# EAGLE design B3PIC_picfinalcurrentreading (EAGLE 9.1.3)
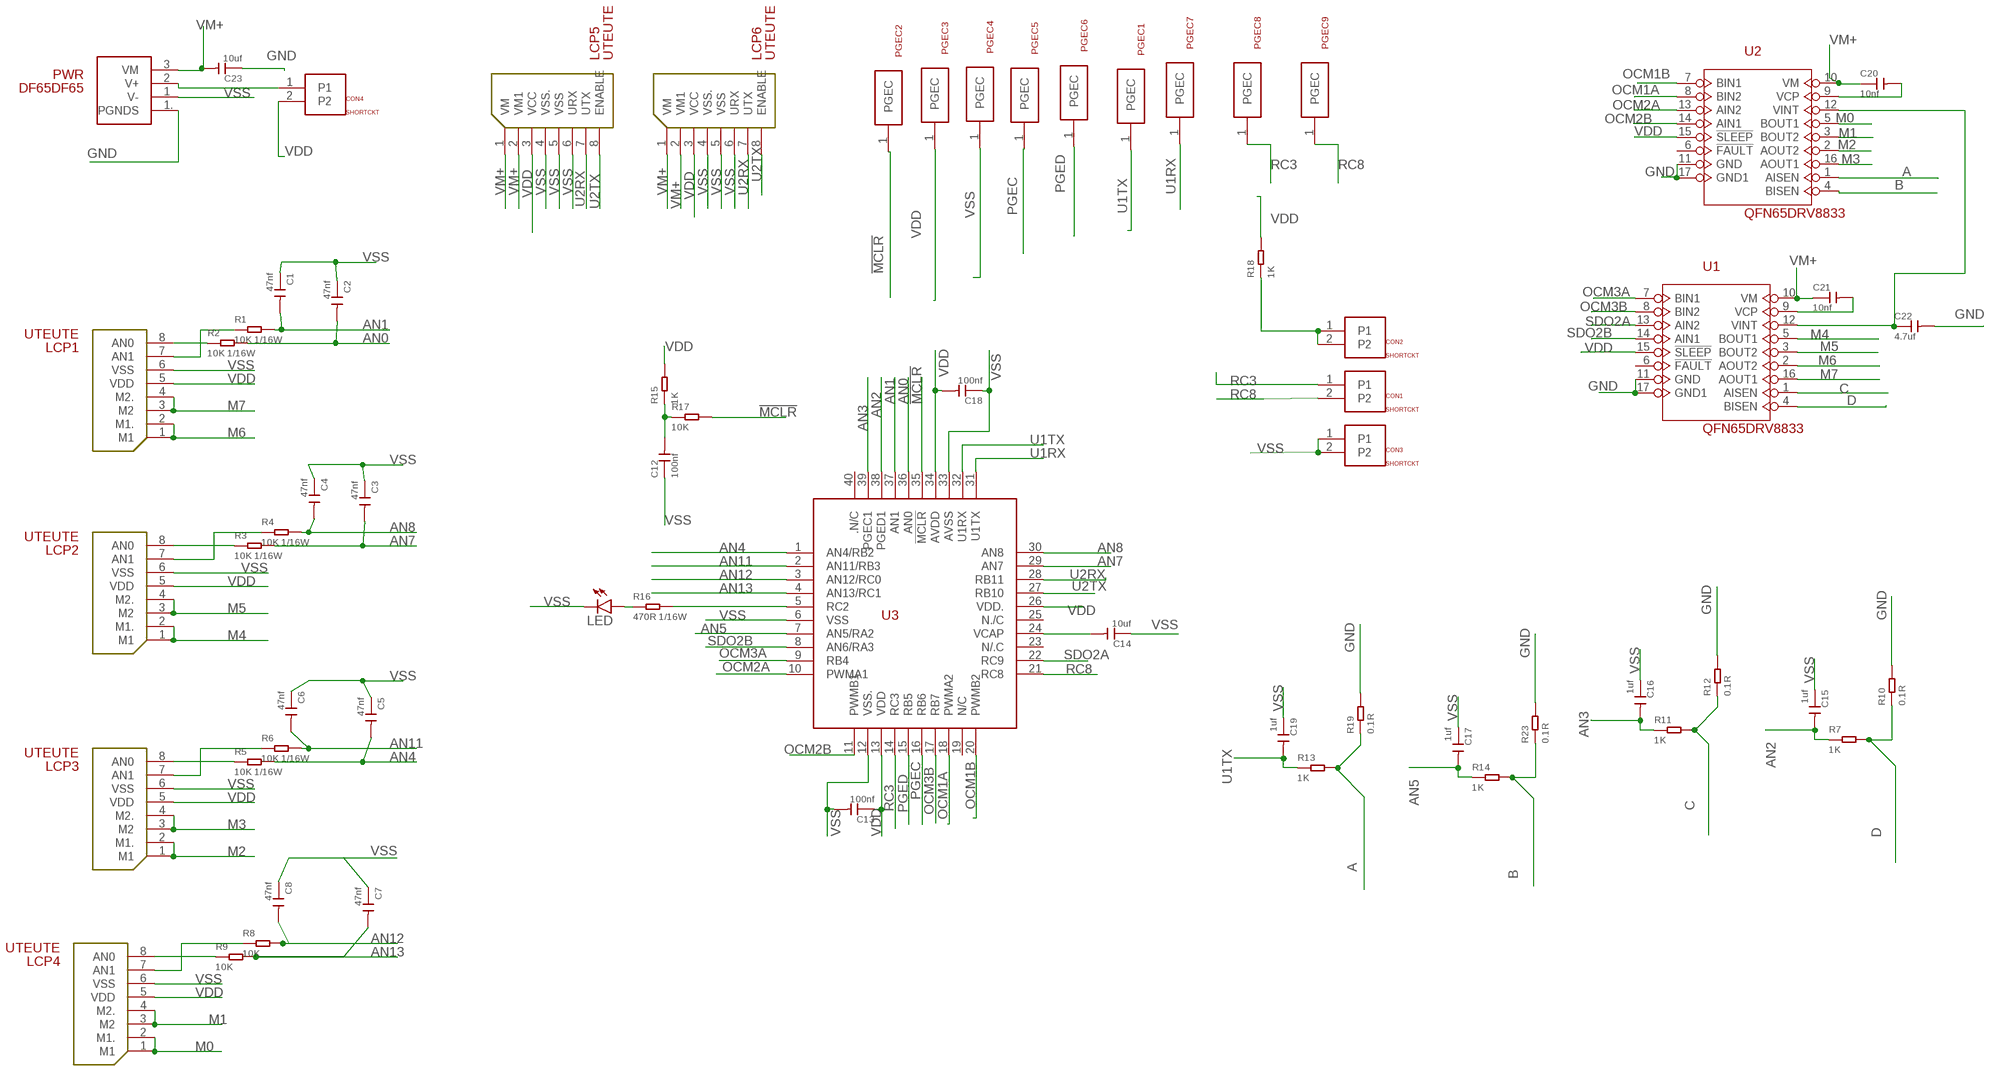
[diagram p0: schematic, sheet 1]

## Parts
C1  47nf  CERAMIC-47NF-25V-10%-X7R(0402)  [C0402]
C2  47nf  CERAMIC-47NF-25V-10%-X7R(0402)  [C0402]
C3  47nf  CERAMIC-47NF-25V-10%-X7R(0402)  [C0402]
C4  47nf  CERAMIC-47NF-25V-10%-X7R(0402)  [C0402]
C5  47nf  CERAMIC-47NF-25V-10%-X7R(0402)  [C0402]
C6  47nf  CERAMIC-47NF-25V-10%-X7R(0402)  [C0402]
C7  47nf  CERAMIC-47NF-25V-10%-X7R(0402)  [C0402]
C8  47nf  CERAMIC-47NF-25V-10%-X7R(0402)  [C0402]
C12  100nf  CERAMIC-100NF-25V-10%-X7R(0402)  [C0402]
C13  100nf  CERAMIC-100NF-25V-10%-X7R(0402)  [C0402]
C14  10uf  CERAMIC-10UF-6.3V-20%-X5R(0402)  [C0402]
C15  1uf  CERAMIC-1UF-10V-10%-X5R(0402)  [C0402]
C16  1uf  CERAMIC-1UF-10V-10%-X5R(0402)  [C0402]
C17  1uf  CERAMIC-1UF-10V-10%-X5R(0402)  [C0402]
C18  100nf  CERAMIC-100NF-25V-10%-X7R(0402)  [C0402]
C19  1uf  CERAMIC-1UF-10V-10%-X5R(0402)  [C0402]
C20  10nf  CERAMIC-10NF-50V-10%-X7R(0402)  [C0402]
C21  10nf  CERAMIC-10NF-50V-10%-X7R(0402)  [C0402]
C22  4.7uf  CERAMIC-4.7UF-6.3V-20%-X5R(0402)  [C0402]
C23  10uf  CERAMIC-10UF-6.3V-20%-X5R(0402)  [C0402]
CON1  SHORTCKT  [SHORT]
CON2  SHORTCKT  [SHORT]
CON3  SHORTCKT  [SHORT]
CON4  SHORTCKT  [SHORT]
LCP1  UTEUTE  [UTE]
LCP2  UTEUTE  [UTE]
LCP3  UTEUTE  [UTE]
LCP4  UTEUTE  [UTE]
LCP5  UTEUTE  [UTE]
LCP6  UTEUTE  [UTE]
LED  LEDCHIP-LED0603  [CHIP-LED0603]
PGEC1  PGECPGEC  [PGEC]
PGEC2  PGECPGEC  [PGEC]
PGEC3  PGECPGEC  [PGEC]
PGEC4  PGECPGEC  [PGEC]
PGEC5  PGECPGEC  [PGEC]
PGEC6  PGECPGEC  [PGEC]
PGEC7  PGECPGEC  [PGEC]
PGEC8  PGECPGEC  [PGEC]
PGEC9  PGECPGEC  [PGEC]
PWR  DF65DF65  [DF65]
R1  10K 1/16W  SMD-RES-10K-1%-1/16W(0402)  [R0402]
R2  10K 1/16W  SMD-RES-10K-1%-1/16W(0402)  [R0402]
R3  10K 1/16W  SMD-RES-10K-1%-1/16W(0402)  [R0402]
R4  10K 1/16W  SMD-RES-10K-1%-1/16W(0402)  [R0402]
R5  10K 1/16W  SMD-RES-10K-1%-1/16W(0402)  [R0402]
R6  10K 1/16W  SMD-RES-10K-1%-1/16W(0402)  [R0402]
R7  1K  SMD-RES-1K-5%-1/16W(0402)  [R0402]
R8  10K  SMD-RES-10K-5%-1/(0402)  [R0402]
R9  10K  SMD-RES-10K-5%-1/(0402)  [R0402]
R10  0.1R  SMD-RES-0.1R-5%-1/8W(0805)  [R0805]
R11  1K  SMD-RES-1K-5%-1/16W(0402)  [R0402]
R12  0.1R  SMD-RES-0.1R-5%-1/8W(0805)  [R0805]
R13  1K  SMD-RES-1K-5%-1/16W(0402)  [R0402]
R14  1K  SMD-RES-1K-5%-1/16W(0402)  [R0402]
R15  1K  SMD-RES-1K-5%-1/16W(0402)  [R0402]
R16  470R 1/16W  SMD-RES-470R-5%-1/16W(0402)  [R0402]
R17  10K  SMD-RES-10K-5%-1/(0402)  [R0402]
R18  1K  SMD-RES-1K-5%-1/16W(0402)  [R0402]
R19  0.1R  SMD-RES-0.1R-5%-1/8W(0805)  [R0805]
R23  0.1R  SMD-RES-0.1R-5%-1/8W(0805)  [R0805]
U1  QFN65DRV8833  [QFN65P400X400X80-17N]
U2  QFN65DRV8833  [QFN65P400X400X80-17N]
U3  PIC32MM0064GPL036PIC32MM0064GPL36  [UQFN40MV5X5MM]

## Nets
!MCLR!: PGEC2.1(PGEC) R17.2 U3.35(!MCLR!)
A: R13.2 R19.1 U2.1(AISEN)
AN0: C2.2 R2.2 U3.36(AN0)
AN1: C1.2 R1.2 U3.37(AN1)
AN2: C15.2 R7.1 U3.38(PGED1)
AN3: C16.2 R11.1 U3.39(PGEC1)
AN4: C5.2 R5.2 U3.1(AN4/RB2)
AN5: C17.2 R14.1 U3.7(AN5/RA2)
AN7: C3.2 R3.2 U3.29(AN7)
AN8: C4.2 R4.2 U3.30(AN8)
AN11: C6.2 R6.2 U3.2(AN11/RB3)
AN12: C8.2 R8.2 U3.3(AN12/RC0)
AN13: C7.2 R9.2 U3.4(AN13/RC1)
B: R14.2 R23.1 U2.4(BISEN)
C: R11.2 R12.1 U1.1(AISEN)
D: R7.2 R10.1 U1.4(BISEN)
GND: C22.2 C23.1 PWR.1.(PGNDS) R10.2 R12.2 R19.2 R23.2 U1.11(GND) U1.17(GND1) U2.11(GND) U2.17(GND1)
M0 [motor line]: LCP4.1(M1) LCP4.2(M1.) U2.5(BOUT1)
M1 [motor line]: LCP4.3(M2) LCP4.4(M2.) U2.3(BOUT2)
M2 [motor line]: LCP3.1(M1) LCP3.2(M1.) U2.2(AOUT2)
M3 [motor line]: LCP3.3(M2) LCP3.4(M2.) U2.16(AOUT1)
M4 [motor line]: LCP2.1(M1) LCP2.2(M1.) U1.5(BOUT1)
M5 [motor line]: LCP2.3(M2) LCP2.4(M2.) U1.3(BOUT2)
M6 [motor line]: LCP1.1(M1) LCP1.2(M1.) U1.2(AOUT2)
M7 [motor line]: LCP1.3(M2) LCP1.4(M2.) U1.16(AOUT1)
N$2: LCP1.8(AN0) R2.1
N$3: CON4.1 PWR.2(V+)
N$4: LCP3.7(AN1) R6.1
N$6: LCP2.8(AN0) R3.1
N$7: LCP4.7(AN1) R8.1
N$8: LCP3.8(AN0) R5.1
N$9: LCP2.7(AN1) R4.1
N$10: LCP1.7(AN1) R1.1
N$11: C12.2 R15.1 R17.1
N$12: R16.2 U3.5(RC2)
N$13: LED.A R16.1
N$15: CON2.1 CON2.2 R18.1
N$17: LCP4.8(AN0) R9.1
N$20: C20.2 U2.9(VCP)
N$22: C21.2 U1.9(VCP)
N$23: C22.1 U1.12(VINT) U2.12(VINT)
N$41: C14.2 U3.24(VCAP)
OCM1A: U2.8(BIN2) U3.18(PWMA2)
OCM1B: U2.7(BIN1) U3.20(PWMB2)
OCM2A: U2.13(AIN2) U3.10(PWMA1)
OCM2B: U2.14(AIN1) U3.11(PWMB1)
OCM3A: U1.7(BIN1) U3.9(RB4)
OCM3B: U1.8(BIN2) U3.17(RB7)
PGEC: PGEC5.1(PGEC) U3.16(RB6)
PGED: PGEC6.1(PGEC) U3.15(RB5)
RC3: CON1.1 PGEC8.1(PGEC) U3.14(RC3)
RC8: CON1.2 PGEC9.1(PGEC) U3.21(RC8)
SDO2A: U1.13(AIN2) U3.22(RC9)
SDO2B: U1.14(AIN1) U3.8(AN6/RA3)
U1RX: PGEC7.1(PGEC) U3.31(U1TX)
U1TX: C19.2 PGEC1.1(PGEC) R13.1 U3.32(U1RX)
U2RX: LCP5.7(UTX) LCP6.7(UTX) U3.28(RB11)
U2TX: LCP5.8(ENABLE) LCP6.8(ENABLE) U3.27(RB10)
VDD [power]: C13.1 C18.2 CON4.2 LCP1.5(VDD) LCP2.5(VDD) LCP3.5(VDD) LCP4.5(VDD) LCP5.3(VCC) LCP6.3(VCC) PGEC3.1(PGEC) R15.2 R18.2 U1.15(!SLEEP!) U2.15(!SLEEP!) U3.13(VDD) U3.26(VDD.) U3.34(AVDD)
VM+ [motor line]: C20.1 C21.1 C23.2 LCP5.1(VM) LCP5.2(VM1) LCP6.1(VM) LCP6.2(VM1) PWR.3(VM) U1.10(VM) U2.10(VM)
VSS [power]: C1.1 C2.1 C3.1 C4.1 C5.1 C6.1 C7.1 C8.1 C12.1 C13.2 C14.1 C15.1 C16.1 C17.1 C18.1 C19.1 CON3.1 CON3.2 LCP1.6(VSS) LCP2.6(VSS) LCP3.6(VSS) LCP4.6(VSS) LCP5.4(VSS.) LCP5.5(VSS) LCP5.6(URX) LCP6.4(VSS.) LCP6.5(VSS) LCP6.6(URX) LED.C PGEC4.1(PGEC) PWR.1(V-) U3.6(VSS) U3.12(VSS.) U3.33(AVSS)
Unconnected: U1.6(!FAULT!) U2.6(!FAULT!) U3.19(N/C) U3.23(N/.C) U3.25(N./C) U3.40(.N/C)

## Library data of the parts
C1-C8 = Seeed-Capacitor:CERAMIC-47NF-25V-10%-X7R(0402): 302010002; MPN: CC0402KRX7R8BB473
C12 C13 C18 = Seeed-Capacitor:CERAMIC-100NF-25V-10%-X7R(0402): 302010024; MPN: CC0402KRX7R8BB104
C14 C23 = Seeed-Capacitor:CERAMIC-10UF-6.3V-20%-X5R(0402): 302010053; MPN: CC0402MRX5R5BB106
C15-C17 C19 = Seeed-Capacitor:CERAMIC-1UF-10V-10%-X5R(0402): 302010040; MPN: CC0402KRX5R6BB105
C20 C21 = Seeed-Capacitor:CERAMIC-10NF-50V-10%-X7R(0402): 302010006; MPN: CC0402KRX7R9BB103
C22 = Seeed-Capacitor:CERAMIC-4.7UF-6.3V-20%-X5R(0402): 302010019; MPN: CC0402MRX5R5BB475
CON1-CON4 = short:SHORT: <this is a point connectors and used for the short circuit the connections point if we needed >
LCP1-LCP4 = ute5526:UTE
LCP5 LCP6 = ute5526(uart):UTE
LED = led:LED: LED OSRAM: - CHIPLED LG R971, LG N971, LY N971, LG Q971, LY Q971, LO R971, LY R971 LH N974, LH R974 LS Q976, LO Q976, LY Q976 LO Q996 - Hyper CHIPLED LW Q18S LB Q993, LB Q99A, LB R99A - SideLED LS A670, LO A670, LY A670, LG A670, LP A670 LB A673, LV A673, LT A673, LW A673 LH A674 LY A675 LS A676, LA A676, LO A676, LY A676, LW A676 LS A679, LY A679, LG A679 - Hyper Micro SIDELED® LS Y876, LA Y876, LO Y876, LY Y876 LT Y87S - SmartLED LW L88C, LW L88S LB L89C, LB L89S, LG L890 LS L89K, LO L89K, LY L89K LS L896, LA L896, LO L896, LY L896 - TOPLED LS T670, LO T670, LY T670, LG T670, LP T670 LSG T670, LSP T670, LSY T670, LOP T670, LYG T670 LG T671, LOG T671, LSG T671 LB T673, LV T673, LT T673, LW T673 LH T674 LS T676, LA T676, LO T676, LY T676, LB T676, LH T676, LSB T676, LW T676 LB T67C, LV T67C, LT T67C, LS T67K, LO T67K, LY T67K, LW E67C LS E67B, LA E67B, LO E67B, LY E67B, LB E67C, LV E67C, LT E67C LW T67C LS T679, LY T679, LG T679 LS T770, LO T770, LY T770, LG T770, LP T770 LB T773, LV T773, LT T773, LW T773 LH T774 LS E675, LA E675, LY E675, LS T675 LS T776, LA T776, LO T776, LY T776, LB T776 LHGB T686 LT T68C, LB T68C - Hyper Mini TOPLED® LB M676 - Mini TOPLED Santana® LG M470 LS M47K, LO M47K, LY M47K Source: http://www.osram.convergy.de LUXEON: - LUMILED® LXK2-PW12-R00, LXK2-PW12-S00, LXK2-PW14-U00, LXK2-PW14-V00 LXK2-PM12-R00, LXK2-PM12-S00, LXK2-PM14-U00 LXK2-PE12-Q00, LXK2-PE12-R00, LXK2-PE12-S00, LXK2-PE14-T00, LXK2-PE14-U00 LXK2-PB12-K00, LXK2-PB12-L00, LXK2-PB12-M00, LXK2-PB14-N00, LXK2-PB14-P00, LXK2-PB14-Q00 LXK2-PR12-L00, LXK2-PR12-M00, LXK2-PR14-Q00, LXK2-PR14-R00 LXK2-PD12-Q00, LXK2-PD12-R00, LXK2-PD12-S00 LXK2-PH12-R00, LXK2-PH12-S00 LXK2-PL12-P00, LXK2-PL12-Q00, LXK2-PL12-R00 Source: www.luxeon.com KINGBRIGHT: KA-3528ASYC Source: www.kingbright.com
PGEC1-PGEC9 = pgec:PGEC: <this is a programming pin for the catchy point means PGEC port>
PWR = df65:DF65: <1.7mm pitch, Low Profile Wire-to-Board Connectors for Power Supplies DF65 series >
R1-R6 = Seeed-Resistor:SMD-RES-10K-1%-1/16W(0402): 301010047; MPN: RC0402FR-0710KL
R7 R11 R13-R15 R18 = Seeed-Resistor:SMD-RES-1K-5%-1/16W(0402): 301010006; MPN: RC0402JR-071KL
R8 R9 R17 = Seeed-Resistor:SMD-RES-10K-5%-1/(0402): 301010004; MPN: RC0402JR-0710KL
R10 R12 R19 R23 = Seeed-Resistor:SMD-RES-0.1R-5%-1/8W(0805): 301010264; MPN: RL0805JR-070R1L
R16 = Seeed-Resistor:SMD-RES-470R-5%-1/16W(0402): 301010013; MPN: RC0402JR-07470RL
U1 U2 = QFN65P400X400X80-17N:QFN65
U3 = pic32xx40:PIC32MM0064GPL036

## Net classes
0 default: width 0.008 mm, clearance 0.152 mm
1 power: width 0 mm, drill 0 mm, clearance 0.152 mm
2 motor line: width 0 mm, clearance 0.152 mm

## Board
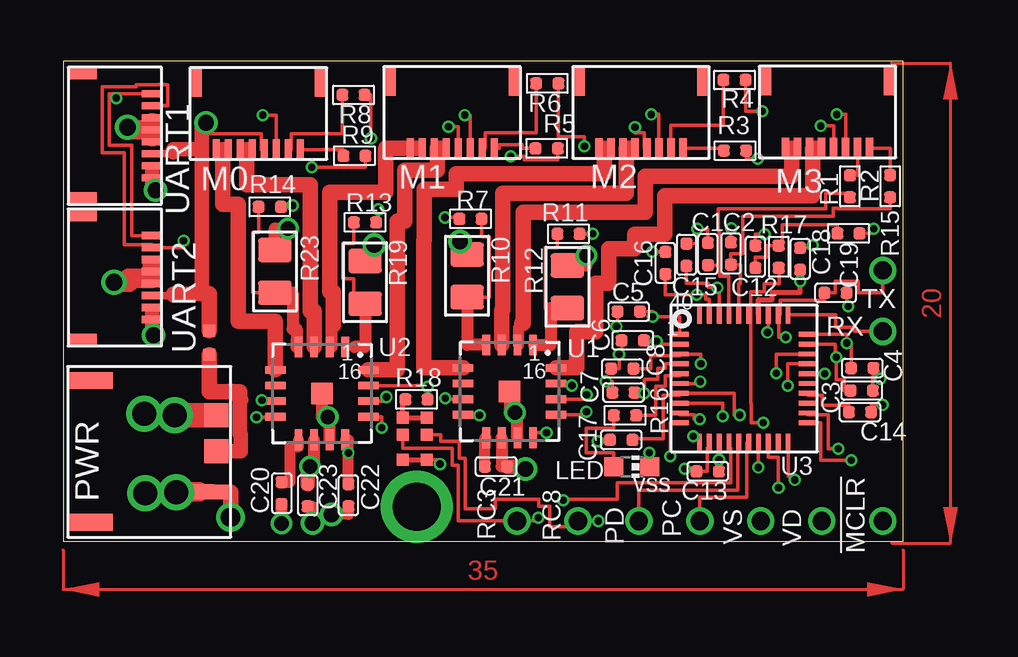
[diagram p1: board, top side]
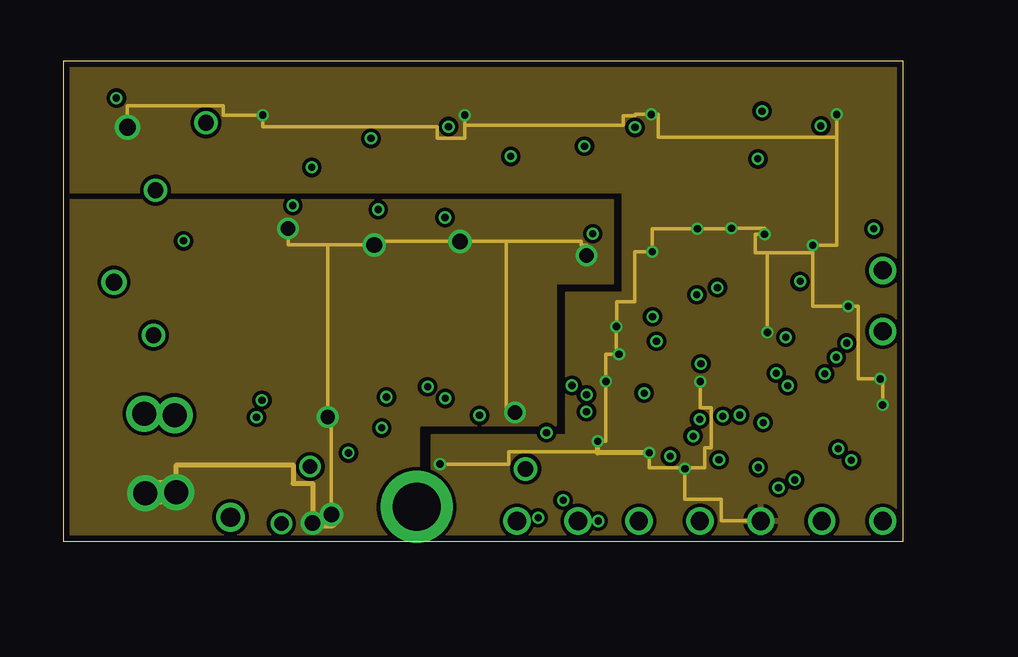
[diagram p2: board, inner layer Route2]
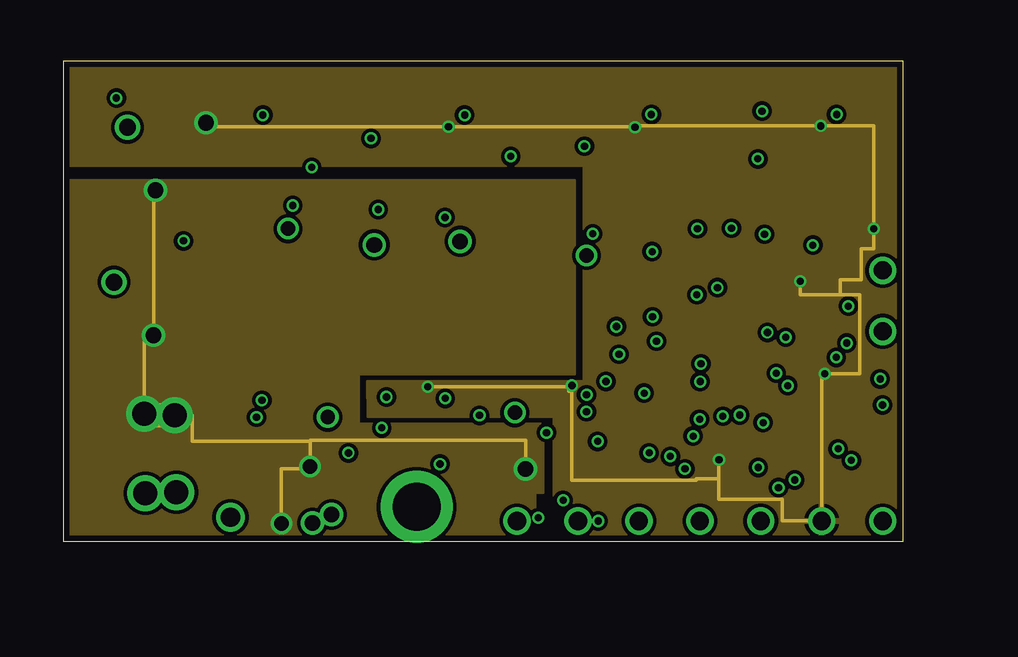
[diagram p3: board, inner layer Route15]
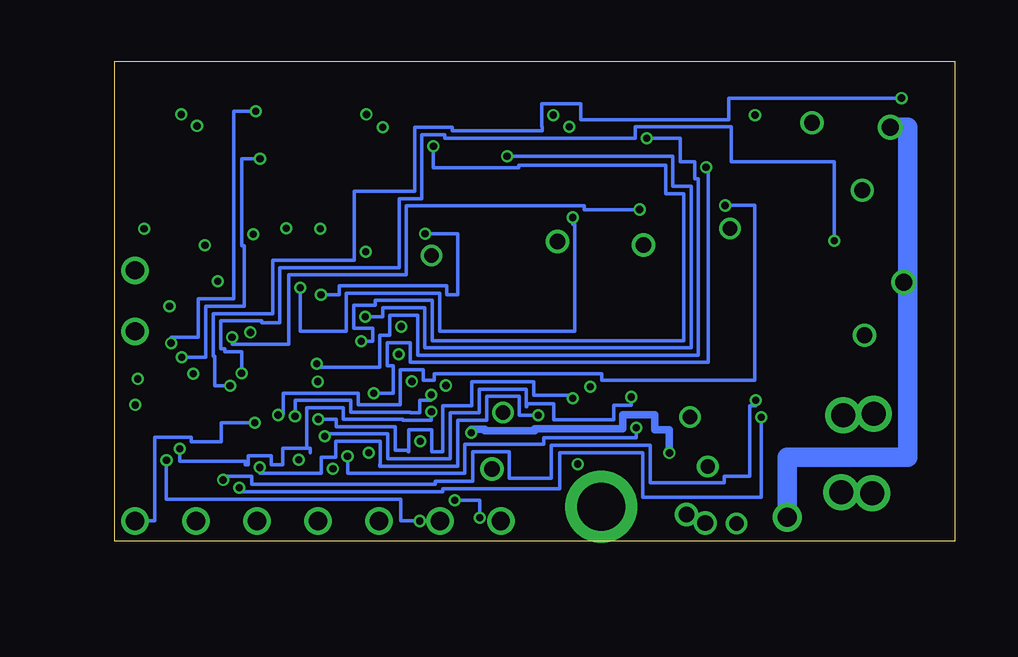
[diagram p4: board, bottom side, seen from below]

Size 35 x 20 mm. Coordinates in mm from the lower left corner, seen from the top.
Outline: 0,0 35,0 35,20 0,20 0,0
Copper layers (1*2*15*16): Top 0.035mm / dielectric 0.2mm / Route2 0.0175mm / dielectric 0.3mm / Route15 0.0175mm / dielectric 0.2mm / Bottom 0.035mm
Design rules "SeeedStudio_4layer_DRU_no_angle_20140221 *": minimum track width 6mil, minimum drill 6mil, track to track 4mil, track to pad 6mil, pad to pad 8mil, via to via 8mil, smd to smd 0mil, copper to edge 10mil, drill to drill 6mil, minimum pad ring 6mil, minimum via ring 4mil, stop-mask expansion 4mil, vias tented up to drill 250mil, thermal gap 6mil

### Footprints (pad centres in the part's own frame; a part is rotated, then mirrored left to right if it is on the bottom)
C0402 = smd 0.5 x 0.5: 1 0,0.463; 2 0,-0.463
SHORT = smd 0.5 x 0.5: 1 0.27,0.46; 2 0.27,-0.54
UTE = smd 0.85 x 0.3: 1 -3.5,1; 2 -3.5,0.5; 3 -3.5,0; 4 -3.5,-0.5; 5 -3.5,-1; 6 -3.5,-1.5; 7 -3.5,-2; 8 -3.5,-2.5 | smd 1.15 x 0.5: 9 -0.725,1.85; 10 -0.725,-3.35
UTE' = smd 0.85 x 0.3: 1 -3.5,1; 2 -3.5,0.5; 3 -3.5,0; 4 -3.5,-0.5; 5 -3.5,-1; 6 -3.5,-1.5; 7 -3.5,-2; 8 -3.5,-2.5 | smd 1.15 x 0.5: 9 -0.625,1.85; 10 -0.625,-3.35
CHIP-LED0603 = smd 0.8 x 0.8: A 0,-0.75; C 0,0.75
PGEC = drill 0.76: 1 0,0
DF65 = smd 1 x 0.6: 1 -2.58,1.73 | smd 1.27 x 0.635: 1. -1.882,1.72 | smd 1 x 1: 2 -2.58,0.03; 3 -2.58,-1.47 | smd 1.8 x 0.7: P$4 2.62,2.98; P$5 2.62,-2.92
R0402 = smd 0.5 x 0.5: 1 0,0.463; 2 0,-0.463
R0805 = smd 1.397 x 1.016: 1 0,0.889; 2 0,-0.889
QFN65P400X400X80-17N = smd 0.86 x 0.32: 1 -1.935,0.975; 2 -1.935,0.325; 3 -1.935,-0.325; 4 -1.935,-0.975; 9 1.935,-0.975; 10 1.935,-0.325; 11 1.935,0.325; 12 1.935,0.975 | smd 0.32 x 0.86: 5 -0.975,-1.935; 6 -0.325,-1.935; 7 0.325,-1.935; 8 0.975,-1.935; 13 0.975,1.935; 14 0.325,1.935; 15 -0.325,1.935; 16 -0.975,1.935 | smd 0.9 x 0.9: 17 0,0
UQFN40MV5X5MM = smd 0.75 x 0.2: 1 -2.63,1.89; 2 -2.63,1.48; 3 -2.63,1.07; 4 -2.63,0.66; 5 -2.63,0.25; 6 -2.63,-0.16; 7 -2.63,-0.57; 8 -2.63,-0.98; 9 -2.63,-1.39; 10 -2.63,-1.8; 21 2.7,-1.8; 22 2.7,-1.39; 23 2.7,-0.98; 24 2.7,-0.57; 25 2.7,-0.16; 26 2.7,0.25; 27 2.7,0.66; 28 2.7,1.07; 29 2.7,1.48; 30 2.7,1.89 | smd 0.2 x 0.75: 11 -1.81,-2.62; 12 -1.4,-2.62; 13 -0.99,-2.62; 14 -0.58,-2.62; 15 -0.17,-2.62; 16 0.24,-2.62; 17 0.65,-2.62; 18 1.06,-2.62; 19 1.47,-2.62; 20 1.88,-2.62; 31 1.88,2.71; 32 1.47,2.71; 33 1.06,2.71; 34 0.65,2.71; 35 0.24,2.71; 36 -0.17,2.71; 37 -0.58,2.71; 38 -0.99,2.71; 39 -1.4,2.71; 40 -1.81,2.71

### Placement (x,y rotation side)
C1  26.86,11.97 0 top
C2  27.83,11.99 0 top
C3  33.27,6.28 270 top
C4  33.3,7.22 270 top
C5  23.57,9.57 90 top
C6  23.73,8.38 90 top
C7  23.35,6.2 90 top
C8  23.3,7.2 90 top
C12  28.84,11.86 0 top
C13  26.86,2.92 270 top
C14  33.2,5.39 270 top
C15  25.97,11.94 0 top
C16  25.09,11.6 0 top
C17  23.26,4.23 90 top
C18  30.71,11.77 0 top
C19  32.18,10.35 270 top
C20  9.11,2.01 180 top
C21  18.04,3.11 270 top
C22  11.89,1.92 0 top
C23  10.19,1.92 180 top
CON1  14.61,4.16 90 top
CON2  14.61,4.88 90 top
CON3  14.62,3.12 90 top
CON4  6.36,8.24 180 top
LCP1  31.1,19.89 90 top
LCP2  23.33,19.87 90 top
LCP3  15.46,19.87 90 top
LCP4  7.38,19.82 90 top
LCP5  UTEUTE  [UTE']  0.21,16.14 180 top
LCP6  UTEUTE  [UTE']  0.21,10.24 180 top
LED  23.7,3.11 270 top
PGEC1  34.15,11.29 0 top
PGEC2  34.15,0.85 0 top
PGEC3  31.61,0.85 0 top
PGEC4  29.07,0.85 0 top
PGEC5  26.53,0.85 0 top
PGEC6  23.99,0.85 0 top
PGEC7  34.15,8.75 0 top
PGEC8  18.91,0.85 0 top
PGEC9  21.45,0.85 0 top
PWR  3.79,3.78 180 top
R1  32.78,14.79 0 top
R2  34.46,14.79 0 top
R3  27.99,16.27 90 top
R4  27.98,19.22 90 top
R5  20.15,16.37 90 top
R6  20.17,19.08 90 top
R7  16.98,13.44 90 top
R8  12.1,18.6 90 top
R9  12.14,16.07 90 top
R10  16.83,11.06 180 top
R11  21.06,12.81 270 top
R12  21.01,10.61 180 top
R13  12.57,13.29 270 top
R14  8.61,13.93 270 top
R15  32.72,12.83 90 top
R16  23.41,5.25 90 top
R17  29.82,11.85 0 top
R18  14.72,5.91 90 top
R19  12.58,10.79 180 top
R23  8.83,11.25 180 top
U1  18.6,6.25 270 top
U2  10.78,6.17 270 top
U3  28.32,6.74 0 top

### Tracks (layer width: path | path; a pad name or v marks a point on that pad's centre or on a via)
!MCLR!  (via drill 0.3)
  Top 0.152: 28.64,9.45 28.64,10.4 29.22,10.4 29.22,10.73 29.83,10.73 29.83,11.39 R17.2 | 28.64,9.45 28.64,5.74 28.68,5.74 28.68,4.95 v29.17,4.95 | U3.35 28.64,9.45
  Bottom 0.152: v29.17,4.95 30.57,4.95 30.57,4.15 31.81,4.15 31.81,4.33 33.32,4.33 33.32,0.85 PGEC2.1
A
  Top 0.152: R19.1 12.11,9.9 12.11,10.94 11.65,10.94 11.65,12.42 12.11,12.42 R13.2 | U2.1 12.14,8.1
  Top 0.508: R19.1 12.58,8.1 12.14,8.1
AN0
  Top 0.152: R2.2 34.46,13.85 32.3,13.85 32.3,13.88 32.09,13.88 32.09,13.55 28.33,13.55 28.33,11.98 27.83,11.98 C2.2 28.21,11.53 28.21,10.72 28.15,10.72 U3.36
AN1
  Top 0.152: C1.2 27.34,11.51 | 27.34,11.51 27.34,12.91 27.29,12.91 27.29,13.85 31.78,13.85 31.78,14.5 32.78,14.5 R1.2 | U3.37 27.74,11.05 27.35,11.05 27.35,11.51 27.34,11.51
AN2  (via drill 0.3)
  Top 0.152: 16.51,13.49 v15.91,13.49 16.51,13.49 | U3.38 27.33,10.57 v27.26,10.57 27.09,10.57 27.09,10.58 26.89,10.58 26.89,10.76 25.97,10.76 C15.2 | R7.1 16.51,13.49
  Bottom 0.152: v15.91,13.49 15.91,13.21 15.83,13.21 15.83,8.75 21.46,8.75 21.46,10.34 25.35,10.34 25.35,8.75 27.26,8.75 v27.26,10.57
AN3  (via drill 0.3)
  Top 0.152: R11.1 v22.07,12.81 | U3.39 26.92,10.09 26.78,10.09 26.78,10.28 26.53,10.28 | 26.53,10.28 v26.41,10.28 | C16.2 25.09,10.28 26.53,10.28
  Bottom 0.152: v26.41,10.28 25.65,10.28 25.65,10.65 21.16,10.65 21.16,10.28 20.71,10.28 20.71,12.81 v22.07,12.81
AN4  (via drill 0.3)
  Top 0.152: v18.65,16.04 19.21,16.04 19.21,15.89 20.61,15.89 R5.2 | C5.2 24.56,9.57 v24.56,9.36 25.69,9.36 U3.1
  Bottom 0.152: v18.65,16.04 11.74,16.04 11.74,14.8 10.98,14.8 10.98,8.06 22.07,8.06 22.07,9.73 23.84,9.73 23.84,9.36 v24.56,9.36
AN5  (via drill 0.3)
  Top 0.152: R14.1 9.57,13.93 v9.57,13.99 | C17.2 23.72,4.28 25,4.28 25,5.79 25,6.08 25.69,6.08 U3.7 27.97,6.17 27.97,5.25 28.19,5.25 v28.19,5.26
  Bottom 0.152: v28.19,5.26 28.19,5.29 27.97,5.29 27.97,6.18 24.86,6.18 24.86,5.69 23.1,5.69 23.1,7.14 22.14,7.14 22.14,6.71 21.68,6.71 21.68,6.97 14.71,6.97 14.71,6.71 8.32,6.71 8.32,13.99 v9.57,13.99
AN7  (via drill 0.3)
  Top 0.152: C3.2 32.54,6.28 32.54,6.74 32.21,6.74 v32.21,7.67 32.21,7.78 32.17,7.78 32.17,8.21 U3.29 | R3.2 28.46,15.94 v28.95,15.94
  Bottom 0.152: v28.95,15.94 29.71,15.94 29.71,12.32 29.61,12.32 29.61,9.79 31.2,9.79 31.2,7.67 v32.21,7.67
AN8  (via drill 0.3)
  Top 0.152: C4.2 32.84,8.26 v32.65,8.26 32.65,8.62 U3.30 | v29.12,17.92 28.44,17.92 R4.2
  Bottom 0.152: v32.65,8.26 32.65,8.5 31.53,8.5 31.53,10.12 30.04,10.12 30.04,17.92 v29.12,17.92
AN11  (via drill 0.3)
  Top 0.152: C6.2 24.2,8.34 v24.72,8.34 24.72,8.21 U3.2 | R6.2 20.63,16.85 21.72,16.85 v21.72,16.46
  Bottom 0.152: v24.72,8.34 24.25,8.34 24.25,8.88 25.04,8.88 25.04,9.84 24.14,9.84 24.14,10.04 21.77,10.04 21.77,8.37 11.29,8.37 11.29,14.49 12.05,14.49 12.05,15.67 18.17,15.67 18.17,15.56 21.72,15.56 v21.72,16.46
AN12  (via drill 0.3)
  Top 0.152: R8.2 12.83,18.6 v12.83,16.79 | C8.2 24.48,7.2 24.48,7.72 25.69,7.72 U3.3 26.58,7.8 v26.58,7.4
  Bottom 0.152: v26.58,7.4 26.58,7.25 23.95,7.25 23.95,8.58 23.54,8.58 23.54,9.43 22.38,9.43 22.38,7.76 10.68,7.76 10.68,15.1 10.84,15.1 10.84,15.82 11.44,15.82 11.44,16.79 v12.83,16.79
AN13  (via drill 0.3)
  Top 0.152: C7.2 24.21,6.2 | 24.21,6.2 v24.21,6.17 | U3.4 25.09,7.39 25.09,7.21 24.79,7.21 24.79,6.76 24.24,6.76 24.24,6.72 24.21,6.72 24.21,6.2 | R9.2 12.6,15.58 v10.36,15.58
  Bottom 0.152: v24.21,6.17 23.4,6.17 23.4,7.32 23.64,7.32 23.64,8.28 22.68,8.28 22.68,7.45 10.27,7.45 10.27,15.58 v10.36,15.58
B
  Top 0.152: R14.2 8.15,12.87 7.9,12.87 7.9,10.36 R23.1 | U2.4 9.73,8.1 9.73,8.36
  Top 0.508: R23.1 9.57,10.36 9.57,8.86 9.73,8.86 9.73,8.36 9.73,8.1
C
  Top 0.152: R11.2 20.59,12.23 20.09,12.23 20.09,9.72 R12.1 | U1.1 19.61,8.18
  Top 0.508: R12.1 20.31,9.72 20.31,8.18 19.61,8.18
D
  Top 0.152: R7.2 17.44,12.69 17.76,12.69 17.76,10.18 R10.1 | U1.4 17.55,8.18
  Top 0.508: R10.1 16.83,8.18 17.55,8.18
GND  (via drill 0.6, 0.65, 1)
  Top 0.45: C22.2 11.89,1.12 v11.18,1.12 | C23.1 10.39,1.45 v10.39,0.77
  Top 0.508: R12.2 21.81,11.49 v21.81,11.91 | R23.2 8.83,13.03 v9.37,13.03 | U1.17 18.6,5.36 v18.83,5.36 18.93,5.36 U1.11 | U2.17 10.78,5.18 v11.03,5.18 11.11,5.18 U2.11
  Top 0.6: R19.2 12.96,11.68 v12.96,12.35
  Top 0.65: R10.2 16.54,11.95 v16.54,12.5
  Top 0.813: v4.72,2.04 5.31,2.04 | 5.31,2.04 5.31,2.06 | PWR.1. 5.31,2.06 | 5.31,2.06 5.31,2.04
  Top 1.016: 4.72,2.06 v4.72,2.04
  Route2 0.152: v11.18,1.12 11.18,5.18 v11.03,5.18 11.03,12.35 v12.96,12.35 | v12.96,12.35 9.37,12.35 v9.37,13.03 | v12.96,12.35 12.96,12.5 v16.54,12.5 18.46,12.5 | 18.46,12.5 21.59,12.5 21.59,12.33 21.81,12.33 v21.81,11.91 | v18.83,5.36 18.46,5.36 18.46,12.5
  Route2 0.2: v4.72,2.04 4.72,3.18 9.59,3.18 9.59,2.41 10.39,2.41 v10.39,0.77
  Route2 0.45: v10.39,0.77 11.18,0.77 v11.18,1.12
  Route2 1.016: v4.72,2.04 3.43,2.04 v3.43,2
  pour Route2: 14.83,-0.48 14.83,4.75 14.84,4.75 14.84,4.83 20,4.83 20.52,4.83 20.52,10.75 22.9,10.75 22.9,14.21 -0.39,14.21 -0.39,12.62 -0.39,-0.49 14.82,-0.49
M0
  Top 0.2: LCP4.1 6.63,16.32 LCP4.2
  Top 0.65: 6.63,16.32 6.66,16.32 6.66,14.05 7.3,14.05 7.3,9.17 8.84,9.17 8.84,8.13 8.85,8.13 U2.5
M1
  Top 0.2: LCP4.3 7.6,16.32 7.66,16.32 LCP4.4
  Top 0.65: 7.66,16.32 7.66,14.85 10.3,14.85 10.3,9.59 10.46,9.59 U2.3
M2
  Top 0.152: U2.2 11.19,8.1
  Top 0.2: 14.73,16.37 LCP3.2
  Top 0.508: 11.26,9.01 11.19,9.01 11.19,8.1
  Top 0.65: 14.73,16.37 LCP3.1 13.44,16.37 13.44,14.55 11.1,14.55 11.1,10.39 11.26,10.39 11.26,9.01
M3
  Top 0.2: LCP3.3 15.76,16.37 LCP3.4
  Top 0.65: U2.16 13.93,7.14 13.93,13.34 14.24,13.34 14.24,15.47 15.59,15.47 15.59,16.37 15.76,16.37
M4
  Top 0.2: LCP2.1 22.55,16.37 LCP2.2
  Top 0.65: U1.5 15.03,7.22 15.03,12.54 15.04,12.54 15.04,14.66 16.39,14.66 16.39,15.31 22.55,15.31 22.55,16.37
M5
  Top 0.2: LCP2.3 23.61,16.37 LCP2.4
  Top 0.65: U1.3 18.28,9.62 18.31,9.62 18.31,14.51 23.45,14.51 23.45,16.37 23.61,16.37
M6
  Top 0.152: U1.2 18.98,8.18
  Top 0.2: LCP1.1 30.36,16.39 LCP1.2
  Top 0.45: 19.11,9.09 19.01,9.09 19.01,8.92 18.98,8.92 18.98,8.18
  Top 0.65: 30.36,16.39 30.36,15.21 24.26,15.21 24.26,13.71 19.18,13.71 19.18,9.09 19.11,9.09
M7
  Top 0.2: LCP1.3 31.42,16.39 LCP1.4
  Top 0.65: 31.42,16.39 31.23,16.39 31.23,14.4 25.06,14.4 25.06,12.8 23.82,12.8 23.82,12.18 22.74,12.18 22.74,10.76 22.19,10.76 22.19,8.73 21.39,8.73 21.39,7.22 U1.16
N$1  (via drill 2)
  other vias: 14.72,1.43
N$2
  Top 0.152: R2.1 34.46,16.39 LCP1.8
N$3
  Top 0.6: PWR.2 7.4,3.75 7.4,4.47 7.35,4.47 7.35,5.88 7.4,5.88 7.4,5.9
  Top 0.65: CON4.1 6.09,6.24 7.36,6.24 7.36,5.9 7.4,5.9
N$4
  Top 0.152: LCP3.7 17.58,16.37 17.58,17.02 19.71,17.02 R6.1
N$6
  Top 0.152: LCP2.8 27.53,16.37 R3.1
N$7
  Top 0.152: LCP4.7 9.51,16.32 9.51,16.98 11.63,16.98 R8.1
N$8
  Top 0.152: R5.1 | LCP3.8 18.17,16.37 18.17,16.52 19.13,16.52 19.13,16.37 R5.1
N$9
  Top 0.152: LCP2.7 25.33,17.33 27.51,17.33 R4.1
N$10
  Top 0.152: R1.1 33.1,15.25 LCP1.7
N$11
  Top 0.152: C12.2 28.84,11.84 29.32,11.84 29.32,12.32 R17.1 29.97,12.32 29.97,13.18 32.26,13.18 R15.1
N$12
  Top 0.152: R16.2 24.69,5.25 24.69,6.45 25.09,6.45 25.09,6.9 25.69,6.9 U3.5
N$13
  Top 0.152: LED.A 22.95,3.69 21.79,3.69 21.79,4.71 22.95,4.71 R16.1
N$15
  Top 0.2: CON2.2 CON2.1 14.15,5.91 R18.1
N$17
  Top 0.152: LCP4.8 11.67,16.32 R9.1
N$20
  Top 0.45: C20.2 9.46,2.47 9.46,3.94 9.81,3.94 U2.9
N$22
  Top 0.45: C21.2 17.58,4.31 U1.9
N$23  (via drill 0.3)
  Top 0.152: U1.12 19.58,4.53 v20.14,4.53
  Top 0.45: C22.1 v11.89,3.68 11.89,4.23 U2.12
  Bottom 0.305: v20.14,4.53 20.14,4.66 19.58,4.66 19.58,4.61 17.5,4.61 17.5,4.69 13.83,4.69 13.83,5.28 12.5,5.28 12.5,4.64 11.89,4.64 v11.89,3.68
N$41
  Top 0.152: C14.2 32.74,5.68 31.63,5.68 31.63,6.08 31.02,6.08 U3.24
OCM1A  (via drill 0.3)
  Top 0.152: U2.8 8.85,5.17 v8.06,5.17 | v29.81,2.24 29.81,3.5 29.38,3.5 U3.18
  Bottom 0.152: v8.06,5.17 8.06,1.84 13,1.84 13,3.7 16.45,3.7 16.45,2.2 21.33,2.2 21.33,2.06 29.81,2.06 v29.81,2.24
OCM1B  (via drill 0.3)
  Top 0.152: U2.7 8.29,5.84 v8.29,5.88 | v30.49,2.56 30.29,2.56 30.29,2.72 30.2,2.72 U3.20
  Bottom 0.152: v8.29,5.88 8.29,5.65 8.54,5.65 8.54,2.72 9.61,2.72 9.61,2.44 12.69,2.44 12.69,4 16.81,4 16.81,2.62 18.56,2.62 18.56,3.74 20.08,3.74 20.08,2.5 21.64,2.5 21.64,2.38 29.28,2.38 29.28,2.72 30.29,2.72 30.29,2.52 30.49,2.52 v30.49,2.56
OCM2A  (via drill 0.3)
  Top 0.152: U2.13 13.28,5.19 v13.28,4.73 | v25.3,3.54 25.3,4.93 U3.10
  Bottom 0.152: v13.28,4.73 13.28,4.31 17.12,4.31 17.12,4.04 20.41,4.04 20.41,2.83 25.3,2.83 v25.3,3.54
OCM2B  (via drill 0.3)
  Top 0.152: U2.14 13.47,5.84 v13.47,6.01 | U3.11 26.51,4.38 v26.25,4.38
  Bottom 0.152: v26.25,4.38 26.09,4.38 26.09,4.47 23.63,4.47 23.63,4.38 23.62,4.38 23.62,4.44 23.62,3.44 21.02,3.44 21.02,5.35 19.81,5.35 19.81,6.35 17.84,6.35 17.84,5.6 17.83,5.6 17.83,5.73 16.71,5.73 16.71,5.07 14.21,5.07 14.21,5.66 13.47,5.66 v13.47,6.01
OCM3A  (via drill 0.3)
  Top 0.152: U1.7 15.92,5.92 v15.92,5.96 | v26.52,5.09 26.3,5.09 26.3,5.26 25.69,5.26 U3.9
  Bottom 0.152: v15.92,5.96 15.92,6.09 17.54,6.09 17.54,6.65 20.11,6.65 20.11,5.65 21.32,5.65 21.32,3.74 21.79,3.74 21.79,4.65 22.75,4.65 22.75,3.74 22.78,3.74 22.78,3.79 23.3,3.79 23.3,4.78 25.77,4.78 25.77,5.09 v26.52,5.09
OCM3B  (via drill 0.3)
  Top 0.152: U1.8 16.67,5.25 v17.35,5.25 | v28.96,3.08 28.97,3.08 U3.17
  Bottom 0.152: v17.35,5.25 18.15,5.25 18.15,6.04 19.5,6.04 19.5,5.04 20.71,5.04 20.71,3.13 23.96,3.13 23.96,3.21 23.94,3.21 23.94,4.17 25.79,4.17 25.79,3.5 26.39,3.5 26.39,2.85 28.96,2.85 v28.96,3.08
PGEC
  Top 0.152: PGEC5.1 26.53,1.83 28.48,1.83 28.48,4.12 U3.16
PGED
  Top 0.152: U3.15 28.11,4.12 28.11,2.14 23.99,2.14 PGEC6.1
RC3  (via drill 0.3)
  Top 0.152: CON1.1 14.15,3.87 16.21,3.87 16.21,3.16 16.45,3.16 16.45,0.85 PGEC8.1 19.79,0.85 v19.79,0.98 | U3.14 27.74,3.88 27.81,3.88 27.81,2.44 25.92,2.44 23.09,2.44 23.09,1.75 20.83,1.75 v20.83,1.71
  Bottom 0.152: v20.83,1.71 19.79,1.71 v19.79,0.98
RC8  (via drill 0.3)
  Top 0.152: CON1.2 15.73,4.43 15.73,4.18 16.51,4.18 16.51,3.46 16.76,3.46 16.76,1.36 18.01,1.36 18.01,1.75 | v22.29,0.85 PGEC9.1 21.45,0.6 20.27,0.6 20.27,1.46 19.81,1.46 19.81,1.75 18.01,1.75 | U3.21 31.57,4.93 31.57,3.37 v32.84,3.37 | 18.01,1.75
  Bottom 0.152: v22.29,0.85 23.09,0.85 23.09,1.75 29.66,1.75 29.66,1.76 32.84,1.76 v32.84,3.37
SDO2A  (via drill 0.3)
  Top 0.152: U1.13 21.8,5.27 v21.8,5.4 | v32.29,3.85 31.87,3.85 31.87,5.26 31.02,5.26 U3.22
  Bottom 0.152: v21.8,5.4 21.8,5.05 23,5.05 23,5.08 25.47,5.08 25.47,5.57 27,5.57 27,3.88 26.85,3.88 | 26.85,3.88 26.85,3.7 26.85,3.88 | 26.85,3.88 28,3.88 28,3.19 28.48,3.19 28.48,3.56 29.44,3.56 29.44,3.19 29.56,3.19 29.56,3.33 32.29,3.33 v32.29,3.85
SDO2B  (via drill 0.3)
  Top 0.152: U3.8 27.49,5.75 v27.49,5.21 | v21.81,6.11 21.81,5.92 U1.14
  Bottom 0.152: v27.49,5.21 27.49,5.87 25.16,5.87 25.16,5.39 22.69,5.39 22.69,5.36 22.29,5.36 22.29,5.88 21.81,5.88 v21.81,6.11
U1RX
  Top 0.152: U3.31 32.18,9.45 32.18,8.93 32.96,8.93 32.96,8.75 PGEC7.1
U1TX  (via drill 0.3)
  Top 0.152: PGEC1.1 34.15,10.35 33.12,10.35 33.12,10.83 32.17,10.83 32.17,10.35 C19.2 31.72,10.05 29.88,10.05 29.88,9.45 U3.32 29.79,9.19 29.82,9.19 29.82,8.5 v30.11,8.5 | R13.1 13.13,13.29 v13.13,13.82
  Bottom 0.152: v13.13,13.82 15.43,13.82 15.43,13.97 22.84,13.97 22.84,11.1 27.75,11.1 27.75,8.21 30.11,8.21 v30.11,8.5
U2RX  (via drill 0.3)
  Top 0.152: LCP5.7 4.36,18.14 4.36,19.02 3.05,19.02 3.05,18.95 1.62,18.95 1.62,16.19 2.55,16.19 2.55,12.36 3.71,12.36 LCP6.7 5.02,12.24 v5.02,12.52 | U3.28 29.71,7.8 v29.71,7
  Bottom 0.152: v29.71,7 29.71,7.91 30.42,7.91 30.42,8.02 30.59,8.02 30.59,9.19 28.86,9.19 28.86,9.1 28.12,9.1 28.12,11.41 23.15,11.41 23.15,14.28 22.2,14.28 22.2,16.94 21.24,16.94 21.24,16.8 13.31,16.8 13.31,17.27 9.31,17.27 9.31,15.81 5.02,15.81 v5.02,12.52
U2TX  (via drill 0.3)
  Top 0.152: LCP6.8 2.85,12.74 2.85,16.5 1.93,16.5 1.93,18.64 2.06,18.64 | 2.06,18.64 LCP5.8 | U3.27 30.19,7.39 v30.19,6.49 | 2.06,18.64 2.06,18.47 v2.22,18.47
  Bottom 0.152: v2.22,18.47 9.41,18.47 9.41,17.57 15.58,17.57 15.58,18.24 17.21,18.24 17.21,17.28 17.19,17.28 17.19,17.11 20.94,17.11 20.94,17.25 22.51,17.25 22.51,14.59 25.03,14.59 25.03,11.71 28.43,11.71 28.43,9.49 30.9,9.49 30.9,7.72 30.83,7.72 30.83,6.49 v30.19,6.49
VDD  (via drill 0.3, 0.65)
  Top 0.152: U2.15 15.19,6.49 v15.19,6.44 v15.18,6.45 R18.2 | v21.2,6.49 20.54,6.49 U1.15 | 5.98,17.2 5.98,16.32 6.01,16.32 6.01,16.98 8.26,16.98 8.26,16.32 LCP4.5 | LCP3.5 16.46,17.28 v16.06,17.28 | v23.83,17.25 23.83,17.02 24.2,17.02 24.2,16.37 LCP2.5 | LCP1.5 32.1,17.31 v31.57,17.31 | R15.2 33.78,12.83 v33.78,13.02 | U3.26 v31.73,6.99 v31.73,6.98
  Top 0.2: C13.1 v27.33,3.4 | v27.33,3.4 | U3.13 v27.33,3.4 | U3.34 28.97,10.07 29.55,10.07 29.55,10.38 30.71,10.38 v30.71,10.83 C18.2
  Top 0.305: 4.58,10.24 LCP6.3 | 4.58,16.2 4.58,16.14 LCP5.3
  Top 0.6: v5.95,17.44 5.98,17.44 5.98,17.2 5.78,17.2 5.78,16.33 | 5.78,16.33 5.78,10.31 4.58,10.31 4.58,10.24 | 5.78,16.33 4.58,16.33 4.58,16.2
  Top 0.65: CON4.2 6.09,10.31 5.78,10.31
  Route15 0.152: v15.19,6.44 21.07,6.44 21.07,6.26 21.2,6.26 v21.2,6.49 21.2,2.54 26.39,2.54 26.39,2.61 27.33,2.61 | 23.83,17.28 v16.06,17.28 5.95,17.28 v5.95,17.44 | 23.83,17.28 v23.83,17.25 | 23.83,17.28 23.83,17.31 v31.57,17.31 33.78,17.31 v33.78,13.02 33.78,12.19 33.25,12.19 33.25,10.89 32.38,10.89 32.38,10.28 | v27.33,3.4 27.33,2.61 | 27.33,2.61 27.33,1.75 29.97,1.75 29.97,0.85 PGEC3.1 31.61,6.98 v31.73,6.98 33.2,6.98 33.2,10.28 32.38,10.28 | v30.71,10.83 30.71,10.28 32.38,10.28
  pour Route15: 20.12,-1.07 20.12,1.64 20.45,1.64 20.45,5.2 12.7,5.2 12.68,6.68 21.69,6.68 21.69,9.92 21.69,15.66 -0.93,15.66 -0.93,20.62 35.19,20.62 35.94,20.62 35.94,-1.31 20.12,-1.31 20.12,-1.1
VM+  (via drill 0.6, 0.65, 1)
  Top 0.152: U2.10 | U1.10 18.27,4.31
  Top 0.2: 3.71,9.56 LCP6.2 | LCP5.1 3.71,15.45 LCP5.2
  Top 0.508: v10.29,3.12 10.46,3.12 10.46,3.57 10.45,3.57 U2.10 | C20.1 9.09,1.54 v9.09,0.74 | C21.1 18.27,3.11 18.27,4.31
  Top 0.6: C23.2 10.19,3.12 v10.29,3.12 | 3.71,9.56 LCP6.1 3.71,8.59 v3.77,8.59 | 3.71,15.45 3.71,14.63 v3.85,14.63 | C21.1 19.27,3.11 v19.27,3.02
  Top 1.016: PWR.3 v4.64,5.25 v4.64,5.26
  Route15 0.152: v3.38,5.32 3.38,8.59 v3.77,8.59 3.77,14.63 v3.85,14.63 | v19.27,3.02 19.27,4.21 10.29,4.21 | 10.29,4.21 10.29,4.16 | 10.29,4.16 v10.29,3.12 10.29,3.02 9.09,3.02 v9.09,0.74 | 10.29,4.21 | v4.64,5.26 5.38,5.26 5.38,4.18 10.29,4.18 10.29,4.16
  Route15 1.016: v4.64,5.26 3.38,5.26 v3.38,5.32
  pour Route15: 19.66,-1.29 19.66,2.02 19.87,2.02 20,2.02 20,4.81 20,4.89 12.32,4.89 12.32,6.95 21.31,6.95 21.31,15.04 21.22,15.04 -1.11,15.04 -1.11,14.77 -1.11,-1.31 19.66,-1.31
VSS  (via drill 0.3, 0.7, 0.8)
  Top 0.152: CON3.2 15.7,3.39 v15.7,3.22 | LCP4.6 8.88,17.76 v8.32,17.76 | v16.73,17.76 16.96,17.76 LCP3.6 | LCP2.6 24.83,17.79 v24.51,17.79 | v32.23,17.79 32.6,17.79 LCP1.6 | C7.1 22.89,6.66 v22.62,6.66 | C6.1 23.27,7.8 v23.16,7.8 23.16,7.2 C8.1 | C5.1 23.1,8.95 v23.05,8.95 | C16.1 v24.54,12.06 v24.54,12.07 | C19.1 32.65,9.8 v32.72,9.8 | v34.04,6.77 33.82,6.77 | 33.82,6.77 33.76,6.77 C4.1 | C3.1 33.74,6.77 33.82,6.77 | C14.1 33.66,5.68 v34.14,5.68 | v25.91,3.02 25.91,2.92 C13.2 26.85,2.92 26.85,3.88 26.92,3.88 U3.12 | U3.33 29.38,8.71 v29.34,8.71 | U3.6 26.54,6.58 v26.54,6.66 | C12.1 28.84,12.8 v29.23,12.8 | C2.1 27.83,13.04 v27.85,13.04 | C1.1 26.86,12.99 26.42,12.99 26.42,13.03 | 26.42,13.03 v26.43,13.03 | C18.1 31.24,12.23 v31.24,12.34 | C15.1 26.42,12.4 26.42,13.03
  Top 0.2: LCP6.4 LCP6.5 3.71,11.48 LCP6.6 | LCP5.4 3.71,16.76 3.71,16.86 LCP5.5 3.71,17.43 LCP5.6 | CON3.1 CON3.2 | LED.C 24.45,3.69 v24.42,3.69 | v22.27,4.17 22.27,4.23 C17.1 | PWR.1 6.98,2.05
  Top 0.65: v6.98,1 6.98,2.05 6.79,2.05
  Top 0.813: v2.12,10.8 2.72,10.8 2.72,10.95 3.71,10.95 3.71,11.48 | 3.71,17.43 3.71,16.86 | LCP5.5 2.68,17.14 v2.68,17.25
  Route2 0.152: v2.68,17.25 2.68,18.16 6.67,18.16 6.67,17.76 v8.32,17.76 8.32,17.27 15.58,17.27 15.58,16.8 16.73,16.8 v16.73,17.76 16.73,17.33 23.35,17.33 23.35,17.73 23.85,17.73 23.85,17.79 v24.51,17.79 24.79,17.79 24.79,16.83 32.23,16.83 v32.23,17.79 32.23,12.34 v31.24,12.34 | v22.27,4.17 22.62,4.17 v22.62,6.66 22.62,7.8 v23.16,7.8 23.05,7.8 v23.05,8.95 23.07,8.95 23.07,9.97 23.82,9.97 23.82,12.07 v24.54,12.07 24.54,13.03 v26.43,13.03 27.85,13.03 v27.85,13.04 29.23,13.04 v29.23,12.8 28.85,12.8 28.85,12.02 29.42,12.02 | v15.7,3.22 18.56,3.22 18.56,3.74 22.27,3.74 22.27,4.04 | v32.72,9.8 32.77,9.8 | 32.77,9.8 33.13,9.8 33.13,6.77 v34.04,6.77 34.14,6.77 v34.14,5.68 | 25.91,3.06 v25.91,3.02 25.91,1.75 27.43,1.75 27.43,0.85 PGEC4.1 | v24.42,3.69 24.42,3.06 25.91,3.06 | v29.34,8.71 29.34,12.02 29.42,12.02 | v26.54,6.66 26.54,5.57 27,5.57 27,3.9 26.73,3.9 26.73,3.06 25.91,3.06 | v31.24,12.34 31.24,12.02 29.42,12.02 | v31.24,12.34 31.24,9.8 32.77,9.8
  Route2 0.2: v24.42,3.69 22.27,3.69 22.27,4.04 v22.27,4.17
  Bottom 0.813: v6.98,1 6.98,3.51 1.95,3.51 1.95,10.8 | 1.95,10.8 v2.12,10.8 | v2.68,17.25 1.95,17.25 1.95,10.8
  pour Route2: 15.35,-0.55 15.35,4.43 20.89,4.43 20.96,4.43 20.96,10.31 20.96,10.35 23.16,10.35 23.32,10.35 23.32,14.54 -0.28,14.54 -0.28,20.19 35.34,20.19 35.34,-0.67 15.35,-0.67
(copper drawn outside any net)
  shapes: Top area x2

### Text on the board
tNames: M0 | M1 | M2 | M3 | UART1 | TX | 40 | 1 | RX | UART2 | 1 | 1 | 16 | 16 | vss | !MCLR! | PD | VS | VD | RC3 | RC8 | PC